# Altium schematic sheet Simple.SchDoc
size A1
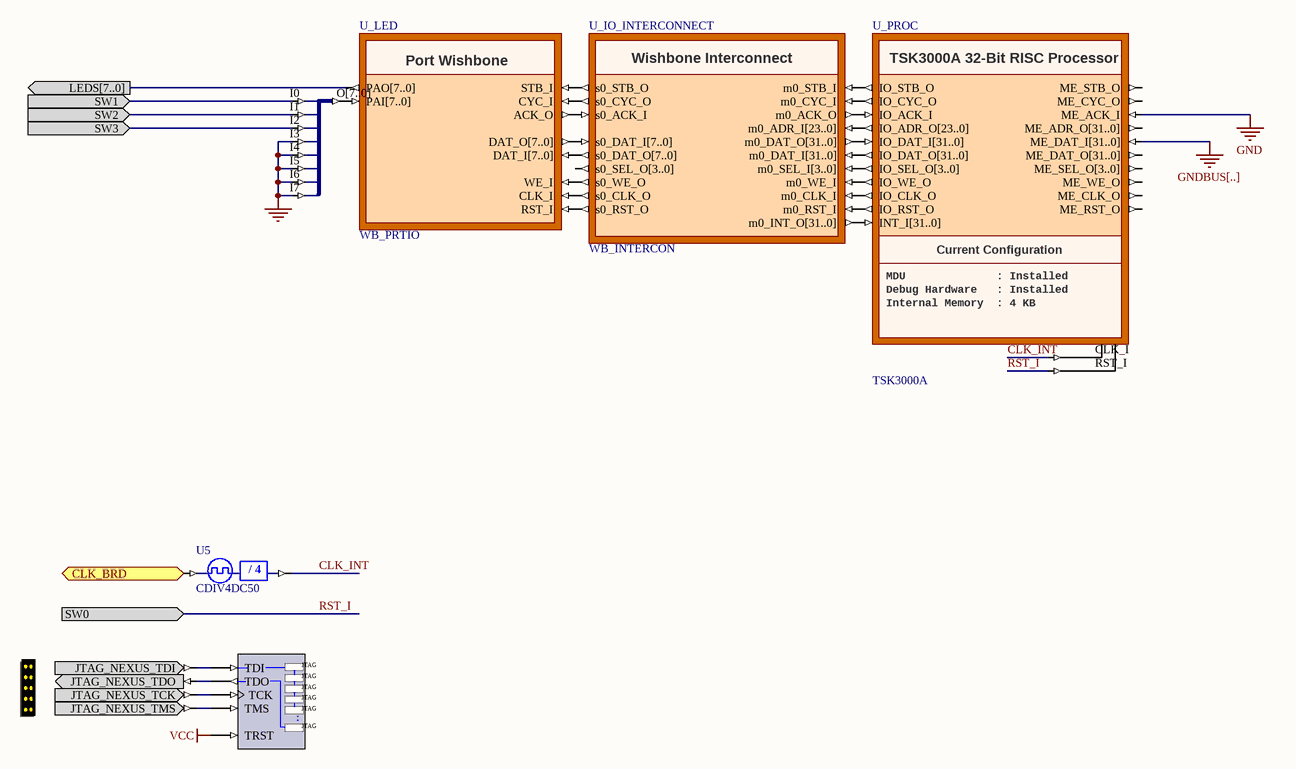
[diagram p0: Simple.SchDoc]

## Parts
?  NEXUS_JTAG_CONNECTOR  (value not drawn)
NEXUS_JTAG_PORT  NEXUS_JTAG_PORT  (value not drawn)
U4  J8S_8B  (value not drawn)
U5  CDIV4DC50
U_IO_INTERCONNECT  WB_INTERCON
U_LED  WB_PRTIO
U_PROC  TSK3000A

## Ports
CLK_BRD (in), LEDS[7..0] (out), SW0 (in), SW1 (in), SW2 (in), SW3 (in)

## Nets
GND: U4.I3 U4.I4 U4.I5 U4.I6 U4.I7 U_PROC.ME_ACK_I
GNDBUS[..]: U_PROC.ME_DAT_I[31..0]
VCC: NEXUS_JTAG_PORT.TRST
CLK_BRD: U5.CLKIN ; port CLK_BRD
CLK_INT: U5.CLKDV U_PROC.CLK_I
LEDS[7..0]: U_LED.PAO[7..0] ; port LEDS[7..0]
RST_I: U_PROC.RST_I ; port SW0
SW1: U4.I0 ; port SW1
SW2: U4.I1 ; port SW2
SW3: U4.I2 ; port SW3
Net?_JTAG_NEXUS_TCK: ?.JTAG_NEXUS_TCK NEXUS_JTAG_PORT.TCK
Net?_JTAG_NEXUS_TDI: ?.JTAG_NEXUS_TDI NEXUS_JTAG_PORT.TDI
Net?_JTAG_NEXUS_TDO: ?.JTAG_NEXUS_TDO NEXUS_JTAG_PORT.TDO
Net?_JTAG_NEXUS_TMS: ?.JTAG_NEXUS_TMS NEXUS_JTAG_PORT.TMS
NetU4_O[7..0]: U4.O[7..0] U_LED.PAI[7..0]
NetU_IO_INTERCONNECT_m0_ACK_O: U_IO_INTERCONNECT.m0_ACK_O U_PROC.IO_ACK_I
NetU_IO_INTERCONNECT_m0_ADR_I[23..0]: U_IO_INTERCONNECT.m0_ADR_I[23..0] U_PROC.IO_ADR_O[23..0]
NetU_IO_INTERCONNECT_m0_CLK_I: U_IO_INTERCONNECT.m0_CLK_I U_PROC.IO_CLK_O
NetU_IO_INTERCONNECT_m0_CYC_I: U_IO_INTERCONNECT.m0_CYC_I U_PROC.IO_CYC_O
NetU_IO_INTERCONNECT_m0_DAT_I[31..0]: U_IO_INTERCONNECT.m0_DAT_I[31..0] U_PROC.IO_DAT_O[31..0]
NetU_IO_INTERCONNECT_m0_DAT_O[31..0]: U_IO_INTERCONNECT.m0_DAT_O[31..0] U_PROC.IO_DAT_I[31..0]
NetU_IO_INTERCONNECT_m0_INT_O[31..0]: U_IO_INTERCONNECT.m0_INT_O[31..0] U_PROC.INT_I[31..0]
NetU_IO_INTERCONNECT_m0_RST_I: U_IO_INTERCONNECT.m0_RST_I U_PROC.IO_RST_O
NetU_IO_INTERCONNECT_m0_SEL_I[3..0]: U_IO_INTERCONNECT.m0_SEL_I[3..0] U_PROC.IO_SEL_O[3..0]
NetU_IO_INTERCONNECT_m0_STB_I: U_IO_INTERCONNECT.m0_STB_I U_PROC.IO_STB_O
NetU_IO_INTERCONNECT_m0_WE_I: U_IO_INTERCONNECT.m0_WE_I U_PROC.IO_WE_O
NetU_IO_INTERCONNECT_s0_ACK_I: U_IO_INTERCONNECT.s0_ACK_I U_LED.ACK_O
NetU_IO_INTERCONNECT_s0_CLK_O: U_IO_INTERCONNECT.s0_CLK_O U_LED.CLK_I
NetU_IO_INTERCONNECT_s0_CYC_O: U_IO_INTERCONNECT.s0_CYC_O U_LED.CYC_I
NetU_IO_INTERCONNECT_s0_DAT_I[7..0]: U_IO_INTERCONNECT.s0_DAT_I[7..0] U_LED.DAT_O[7..0]
NetU_IO_INTERCONNECT_s0_DAT_O[7..0]: U_IO_INTERCONNECT.s0_DAT_O[7..0] U_LED.DAT_I[7..0]
NetU_IO_INTERCONNECT_s0_RST_O: U_IO_INTERCONNECT.s0_RST_O U_LED.RST_I
NetU_IO_INTERCONNECT_s0_STB_O: U_IO_INTERCONNECT.s0_STB_O U_LED.STB_I
NetU_IO_INTERCONNECT_s0_WE_O: U_IO_INTERCONNECT.s0_WE_O U_LED.WE_I

Not connected (* = marked no-connect by the designer): U_IO_INTERCONNECT s0_SEL_O[3..0]; U_PROC ME_ADR_O[31..0] ME_CLK_O ME_CYC_O ME_DAT_O[31..0] ME_RST_O ME_SEL_O[3..0] ME_STB_O ME_WE_O

## Notes on the sheet
- (in symbol CDIV4DC50) / 4
- (in symbol NEXUS_JTAG_PORT) JTAG; .
- (in symbol TSK3000A) TSK3000A 32-Bit RISC Processor; Current Configuration; MDU              : Installed; Debug Hardware   : Installed; Internal Memory  : 4 KB
- (in symbol WB_INTERCON) Wishbone Interconnect
- (in symbol WB_PRTIO) Port Wishbone

## Library data of the parts
? = NEXUS_JTAG_CONNECTOR: JTAG Port; PortComponent: True; Published: 19-Nov-2003; Publisher: Altium Limited
NEXUS_JTAG_PORT = NEXUS_JTAG_PORT: Soft Nexus-Chain Connector; NEXUS_JTAG_CONNECTOR: True; Published: 18-Dec-2003; Publisher: Altium Limited
U4 = J8S_8B: 8 Single pin inputs to single 8-Bit output bus; FunctionalClass: Bus Joiner; PortSize: 8; ArchiveName: GENERIC; VHDLIB_SIM: GENERIC_LIB; Published: 29-Jan-2004; Publisher: Altium Limited; LastRevisionNo: 1.00.00; HelpURL: CR0118 FPGA Generic Library Guide.pdf#page=305; ComponentLink1URL: CR0126 FPGA Bus Joiner Resource Usage.pdf#page=28; ComponentLink1Description: Core &Resource Usage
U5 = CDIV4DC50: Clock Divider by 4 with 50% Duty Cycle Output; XilinxEquivalent: CLK_DIV4; DivisorRate: 4; DutyCycle: 50; ArchiveName: GENERIC; VHDLIB_SIM: GENERIC_LIB; Published: 29-Jan-2004; Publisher: Altium Limited; LastRevisionNo: 1.00.00; HelpURL: CR0118 FPGA Generic Library Guide.pdf#page=143; ComponentLink1URL: CR0127 FPGA Clock Divider Resource Usage.pdf#page=6; ComponentLink1Description: Core &Resource Usage; FunctionalClass: Clock Divider
U_IO_INTERCONNECT = WB_INTERCON: Configurable Wishbone Interconnect; ConfigurationParameters: {}Version[1.0]{}UnusedInterrupts[1]{}MasterAddressBits[1]{}Name0[LED]{}Kind0[0]{}SpaceAfter0[4]{}Address_Base0[0]{}Address_UsedRange0[1]{}Address_Bits0[0]{}Address_Mode0[1]{}Address_DecodeWidth0[8]{}DataWidth0[2]{}UsedInterrupts0[ ]; ComponentLink1Description: Core &Resource Usage; ComponentLink1URL: CR0139 FPGA Peripheral Resource Usage.pdf#page=52; HelpURL: CR0150 WB_INTERCON Configurable Wishbone Interconnect.pdf; LastRevisionNo: 1.00.00; Published: 9-Dec-2004; Publisher: Altium Limited; ConfiguratorName: WB_INTERCON
U_LED = WB_PRTIO: Configurable Port Wishbone; ConfigurationParameters: {}Version[2.0]{}Signal0Name[PA]{}Signal0Type[In/Out]{}Signal0BusString[{1}7..0{2}]{}Signal0Address[0]{}Signal0SpaceAfter[0]{}; ComponentLink1Description: Core &Resource Usage; ComponentLink1URL: CR0139 FPGA Peripheral Resource Usage.pdf#page=63; HelpURL: CR0154 WB_PRTIO Configurable Wishbone Parallel Port Unit.pdf; LastRevisionNo: 1.00.00; Published: 9-Dec-2004; Publisher: Altium Limited; ConfiguratorName: WB_PRTIO
U_PROC = TSK3000A: TSK3000A OCD Microprocessor; ChildModel1: TSK3000A_MCU; Nexus_JTAG_Device: True; Nexus_Core: Processor_OCDS; Nexus_JTAG_Order: 0; ChildModel2: TSK3000A_MDU; ChildModel3: TSK3000A_OCDS; ChildModel4: TSK3000A_Shift_Barrel; ChildModel5: TSK3000A_Shift_Sequential; ChildModel6: Mult_32x32; ConfigurationParameters: {}Version[1.0]{}Option_Processor[0]{}Option_Memory[2]{}Option_MDU[0]{}Option_OCDS[0]{}Option_Shifter[0]{}Option_InterruptCount[32]{}Option_DebugWhenReset[0]{}; ChildModel7: m33x33; ConfiguratorName: FPGA_MCU32; Memory_Configuration: Record[NEXUS_CORE]{}ComponentDesignator[xrom]{}Memory_Depth[128]{}Memory_UsageType[rom]{}ProgramDownloadAddress[0]{}Memory_BusType[TSK3000:addr_bus]{}Memory_Mau[8]{}Memory_MatchedComponent[]{}Memory_Description[]{}Memory_FillBitPattern[]{}Memory_Interrupts[]{n}Record[NEXUS_CORE]{}ComponentDesignator[xram]{}Memory_Depth[3k]{}Memory_UsageType[ram]{}ProgramDownloadAddress[1k]{}Memory_BusType[TSK3000:addr_bus]{}Memory_Mau[8]{}Memory_MatchedComponent[]{}Memory_Description[]{}Memory_FillBitPattern[]{}Memory_Interrupts[]{n}Record[CODE_EXPORT]{}ExportType[1]{n}Record[PERIPHERAL]{}ComponentDesignator[LED]{}Memory_Depth[0x0001]{}Memory_UsageType[peripheral]{}ProgramDownloadAddress[0xFF000000]{}Memory_BusType[TSK3000:addr_bus]{}Memory_Mau[8]{}Memory_MatchedComponent[]{}Memory_Description[U4]{}Memory_FillBitPattern[]{}Memory_Interrupts[]{n}; ProgramLogicalTopAddress: 0; ComponentLink1Description: Core &Resource Usage; ComponentLink1URL: CR0140 FPGA Processor Resource Usage.pdf#page=20; HelpURL: CR0121 TSK3000A 32 bit RISC Processor.pdf; LastRevisionNo: 1.00.00; Published: 17-Nov-2004; Publisher: Altium Limited; ComponentLink2Description: Embedded &Tools Guide; ComponentLink2URL: GU0111 Using the TSK3000 Embedded Tools.pdf; ComponentLink3Description: Embedded T&echnical References; ComponentLink3URL: TR0109 TSK3000 Embedded Tools Reference.pdf